# EAGLE design H2OhNo-v10 (EAGLE 6.3)
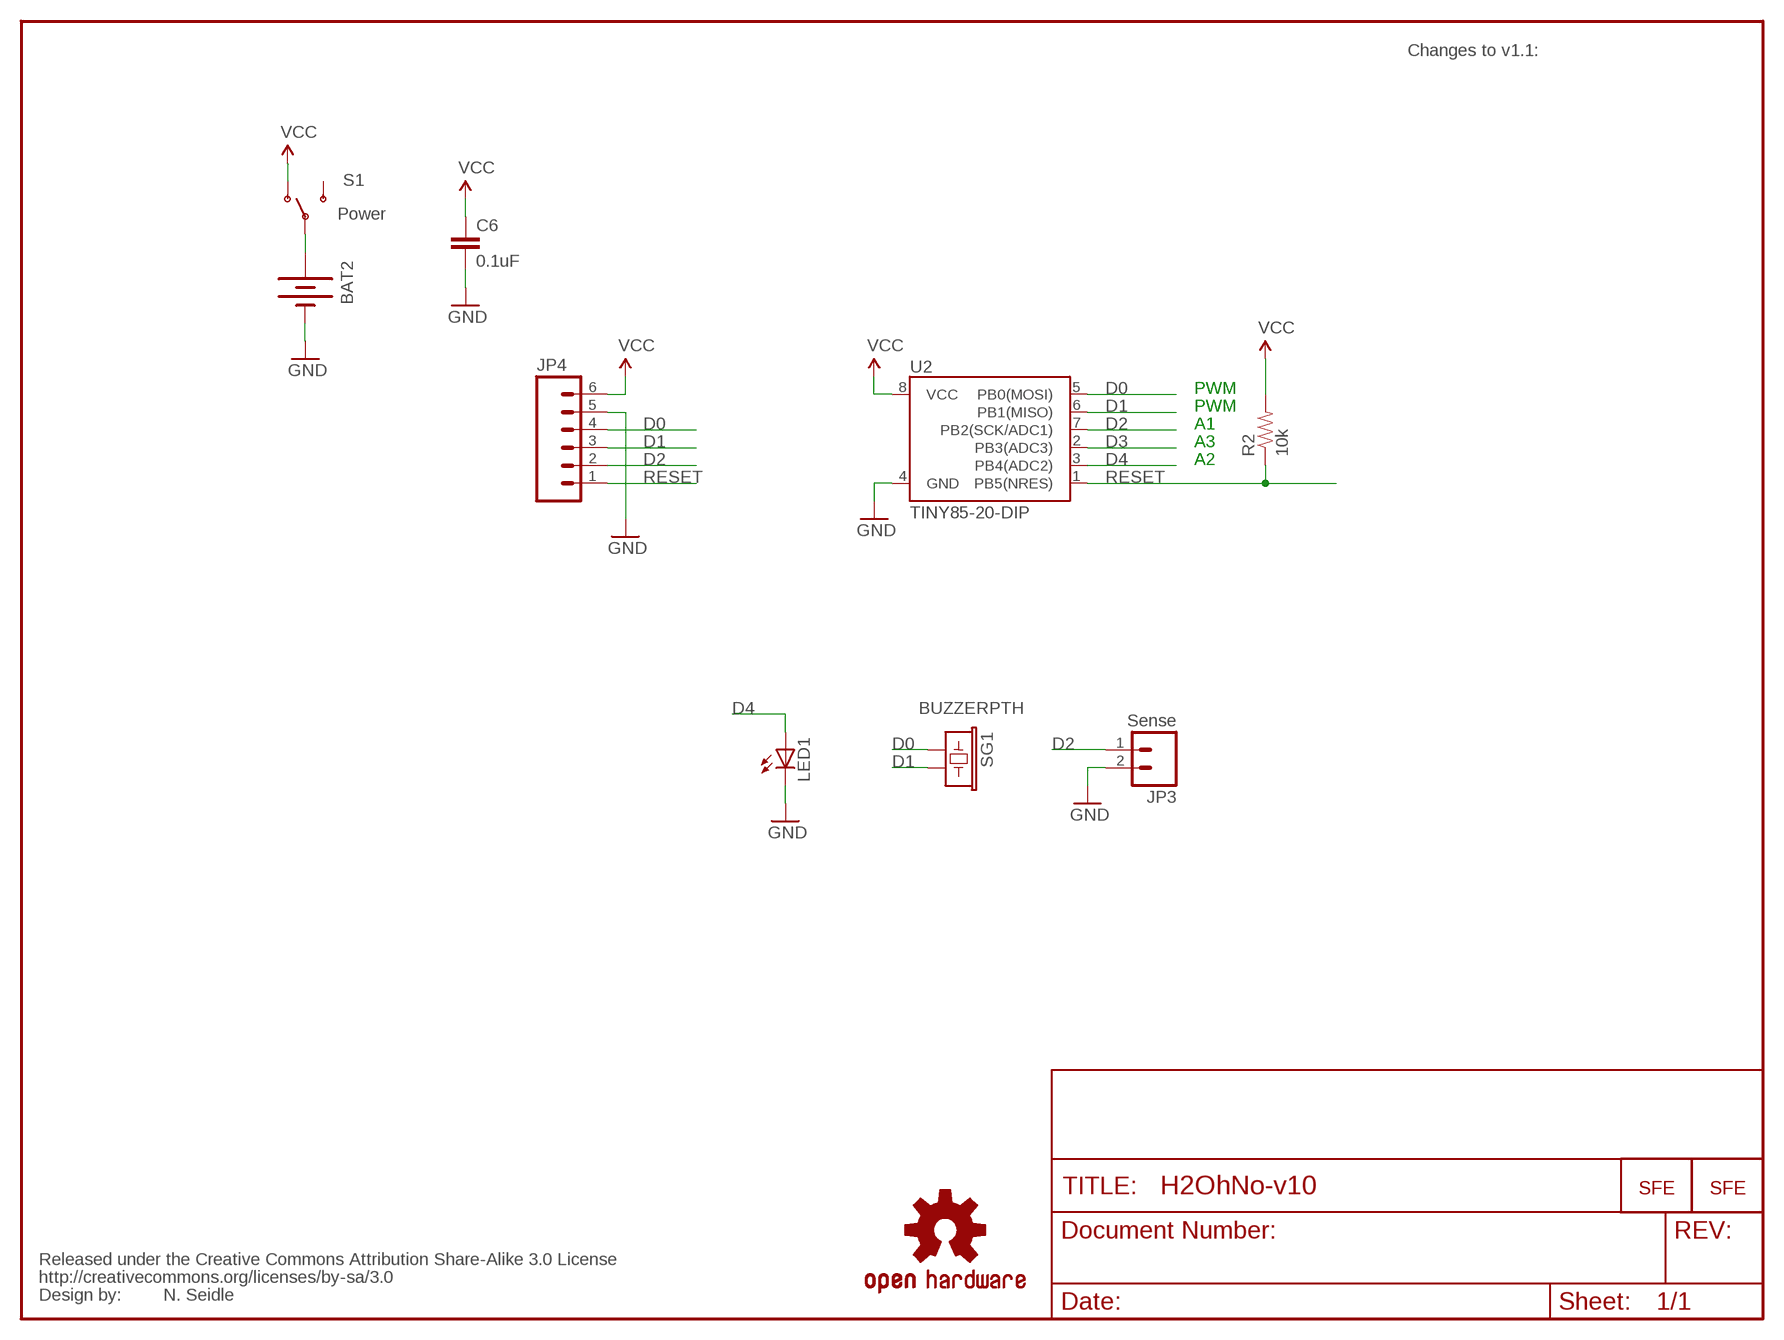
[diagram p0: schematic, sheet 1]

## Parts
BAT2  BATTERY20PTH  [BATTCOM_20MM_PTH]
C6  0.1uF  CAPPTH2  [CAP-PTH-SMALL2]
JP3  Sense  M02PTH  [1X02]
JP4  M06SIP  [1X06]
LED1  LED5MM  [LED5MM]
R2  10k  RESISTORAXIAL-0.3  [AXIAL-0.3]
S1  Power  SWITCH-SPDTPTH  [SWITCH-SPDT]
SG1  BUZZERPTH  [BUZZER-12MM]
U2  TINY85-20-DIP  ATTINY45TINY85-20-DIP  [DIP08]
U$1  LOGO-SFESK  [SFE-LOGO-FLAME]
U$2  CREATIVE_COMMONS  [CREATIVE_COMMONS]
U$4  OSHW-LOGOS  [OSHW-LOGO-S]
U$5  LOGO-SFENW2  [SFE-NEW-WEB]

## Nets
D0: JP4.4 SG1.+ U2.5(PB0(MOSI))
D1: JP4.3 SG1.- U2.6(PB1(MISO))
D2: JP3.1 JP4.2 U2.7(PB2(SCK/ADC1))
D3: U2.2(PB3(ADC3))
D4: LED1.A U2.3(PB4(ADC2))
GND: BAT2.2(-) C6.2 JP3.2 JP4.5 LED1.K(C) U2.4(GND)
N$1: BAT2.1(+) S1.2(P)
RESET: JP4.1 R2.P$1 U2.1(PB5(NRES))
VCC: C6.1 JP4.6 R2.P$2 S1.1(O) U2.8(VCC)
Unconnected: S1.3(S)

## Notes on the sheet
- Changes to v1.1:
- PWM
- PWM
- A1
- A3
- A2
- N. Seidle

## Library data of the parts
BAT2 = Testing:BATTERY: Battery Holders Various common sizes : AA, AAA, 20mm coin cell and 12mm coin cell.
C6 = SparkFun:CAP: Capacitor Standard 0603 ceramic capacitor, and 0.1" leaded capacitor.
JP3 = SparkFun-Connectors:M02: Header 2 Standard 2-pin 0.1" header. Use with straight break away headers (SKU : PRT-00116), right angle break away headers (PRT-00553), swiss pins (PRT-00743), machine pins (PRT-00117), and female headers (PRT-00115). Molex polarized connector foot print use with SKU : PRT-08233 with associated crimp pins and housings.
JP4 = SparkFun-Connectors:M06: Header 6 Standard 6-pin 0.1" header. Use with straight break away headers (SKU : PRT-00116), right angle break away headers (PRT-00553), swiss pins (PRT-00743), machine pins (PRT-00117), and female headers (PRT-00115). Molex polarized connector foot print use with SKU : PRT-08094 with associated crimp pins and housings. NOTES ON THE VARIANTS LOCK and LOCK_LONGPADS... This footprint was designed to help hold the alignment of a through-hole component (i.e. 6-pin header) while soldering it into place. You may notice that each hole has been shifted either up or down by 0.005 of an inch from it's more standard position (which is a perfectly straight line). This slight alteration caused the pins (the squares in the middle) to touch the edges of the holes. Because they are alternating, it causes a "brace" to hold the component in place. 0.005 has proven to be the perfect amount of "off-center" position when using our standard breakaway headers. Although looks a little odd when you look at the bare footprint, once you have a header in there, the alteration is very hard to notice. Also, if you push a header all the way into place, it is covered up entirely on the bottom side. This idea of altering the position of holes to aid alignment will be further integrated into the Sparkfun Library for other footprints. It can help hold any component with 3 or more connection pins.
LED1 = SparkFun-LED:LED: LEDs Standard schematic elements and footprints for 5mm, 3mm, 1206, and 0603 sized LEDs. 5mm - Spark Fun Electronics SKU : COM-00529 (and others)
R2 = SparkFun:RESISTOR: Resistor Basic schematic elements and footprints for 0603, 1206, and PTH resistors.
S1 = SparkFun-Electromechanical:SWITCH-SPDT: SPDT Switch Simple slide switch, Spark Fun Electronics SKU : COM-00102 DPDT SMT slide switch, AYZ0202, SWCH-08179
SG1 = SparkFun-Electromechanical:BUZZER: Buzzer 12mm Spark Fun Electronics SKU : Comp-Buzzer
U2 = SparkFun-DigitalIC:ATTINY45: Atmel 8-pin 2/4/8kB flash uC; PROD_ID: IC-09445
U$1 U$5 = SparkFun:LOGO-SFE: Spark Fun Electronics PCB Logo This is the standard Spark Fun Electronics PCB logo.
U$2 = SparkFun:CREATIVE_COMMONS
U$4 = SparkFun:OSHW-LOGO: Open Source Hardware Logo This logo indicates the piece of hardware it is found on incorporates a OSHW license and/or adheres to the definition of open source hardware found here: http://freedomdefined.org/OSHW

## Board
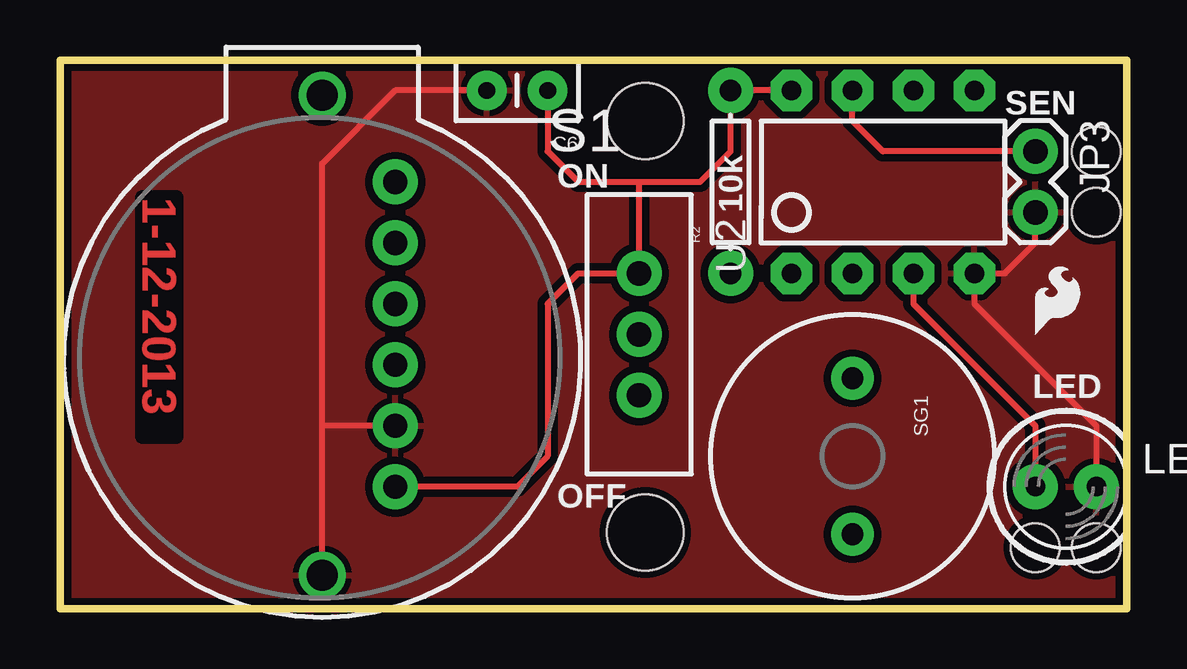
[diagram p1: board, top side]
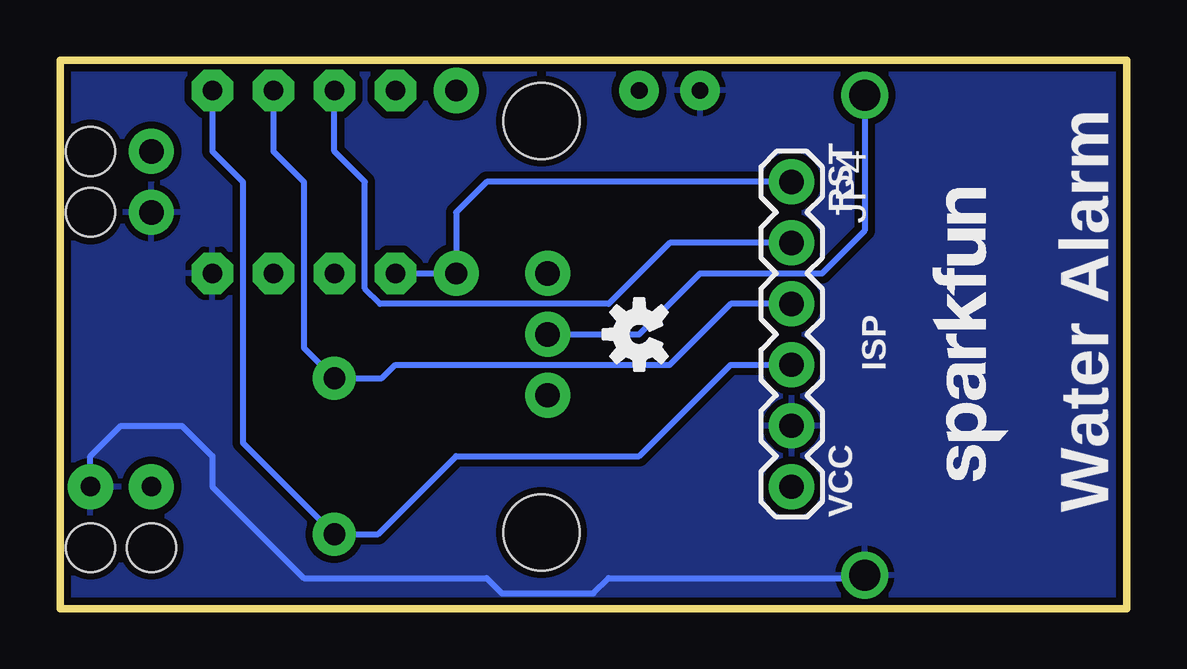
[diagram p2: board, bottom side, seen from below]

Size 44.45 x 22.86 mm. Coordinates in mm from the lower left corner, seen from the top.
Outline: 0,22.86 0,0 44.45,0 44.45,22.86 0,22.86
Copper layers (1*16): Top 0.035mm / dielectric 1.5mm / Bottom 0.035mm
Design rules "SparkFun": minimum track width 8mil, minimum drill 20mil, track to track 8mil, track to pad 8mil, pad to pad 8mil, via to via 8mil, smd to smd 8mil, copper to edge 10mil, drill to drill 8mil, minimum pad ring 12mil, minimum via ring 10mil, stop-mask expansion 4mil, vias tented up to drill 25mil, thermal gap 10mil
Holes 3.17 mm at 24.38,20.32 24.38,3.17
Holes 2.03 mm at 43.18,19.05 43.18,16.51 40.64,2.54 43.18,2.54

### Footprints (pad centres in the part's own frame; a part is rotated, then mirrored left to right if it is on the bottom)
BATTCOM_20MM_PTH = drill 1.3: 1 20,0; 2 0,0
CAP-PTH-SMALL2 = drill 0.7 pad 1.651: 1 0,0; 2 2.54,0
1X02 = drill 1.016 pad 1.88: 1 0,0; 2 2.54,0
1X06 = drill 1.016 pad 1.88: 1 0,0; 2 2.54,0; 3 5.08,0; 4 7.62,0; 5 10.16,0; 6 12.7,0
LED5MM = drill 0.813 pad 1.88: A -1.27,0; K 1.27,0
AXIAL-0.3 = drill 0.9 pad 1.88: P$1 -3.81,0; P$2 3.81,0
SWITCH-SPDT = drill 1.016 pad 1.88: 1 0,2.54; 2 0,0; 3 0,-2.54
BUZZER-12MM = drill 0.9 pad 1.778: + 3.25,0; - -3.25,0
DIP08 = drill 0.813 pad 1.727 octagon: 1 -3.81,-3.81; 2 -1.27,-3.81; 3 1.27,-3.81; 4 3.81,-3.81; 5 3.81,3.81; 6 1.27,3.81; 7 -1.27,3.81; 8 -3.81,3.81

### Placement (x,y rotation side)
BAT2  10.92,1.4 90 top
C6  20.32,21.59 180 top
JP3  40.64,19.05 270 top
JP4  13.97,17.78 270 bottom
LED1  41.91,5.08 0 top
R2  27.94,17.78 90 top
S1  24.13,11.43 0 top
SG1  33.02,6.35 270 top
U2  34.29,17.78 0 top
U$1  40.64,11.43 0 top
U$2  -6.35,-10.16 0 top  (outside the outline)
U$4  20.32,11.43 90 bottom
U$5  4.95,5.33 90 bottom

### Tracks (layer width: path | path; a pad name or v marks a point on that pad's centre or on a via)
D0
  Bottom 0.254: U2.5 38.1,19.05 36.83,17.78 36.83,6.91 SG1.+ 31.19,3.1 27.94,6.35 20.32,6.35 16.51,10.16 JP4.4
D1
  Bottom 0.254: JP4.3 16.51,12.7 19.05,10.16 30.48,10.16 31.04,9.6 SG1.- 34.29,10.87 34.29,17.78 35.56,19.05 U2.6
D2
  Top 0.254: JP3.1 34.29,19.05 33.02,20.32 U2.7
  Bottom 0.254: JP4.2 19.05,15.24 21.59,12.7 31.11,12.7 31.75,13.34 31.75,17.78 33.02,19.05 U2.7
D4
  Top 0.254: U2.3 35.56,12.7 40.64,7.62 LED1.A
GND
  Top 0.254: JP3.2 40.64,15.24 39.37,13.97 U2.4 38.1,12.7 43.18,7.62 LED1.K | C6.2 13.97,21.59 10.92,18.54 10.92,7.62 | BAT2.2 10.92,7.62 | JP4.5 10.92,7.62
  Bottom 0.254: LED1.K 43.18,6.35 41.91,7.62 39.37,7.62 38.1,6.35 38.1,5.08 34.29,1.27 26.67,1.27 26.04,0.64 22.23,0.64 21.59,1.27 11.05,1.27 BAT2.2
  pour Bottom (isolate 0.305): 0,22.86 44.45,22.86 44.45,0 0,0
  pour Top (isolate 0.305): 0,22.86 44.45,22.86 44.45,0 0,0
N$1
  Bottom 0.254: S1.2 20.32,11.43 17.78,13.97 12.7,13.97 10.92,15.75 BAT2.1
RESET
  Bottom 0.254: JP4.1 26.67,17.78 27.94,16.51 R2.P$1 U2.1
VCC
  Top 0.254: U2.8 R2.P$2 27.94,19.05 26.67,17.78 24.13,17.78 | JP4.6 19.05,5.08 20.32,6.35 20.32,12.7 21.59,13.97 S1.1 24.13,17.78 | C6.1 20.32,19.05 21.59,17.78 24.13,17.78

### Text on the board
Top: 1-12-2013
tPlace: SEN | ON | LED | OFF
bPlace: Water Alarm | RST | ISP | VCC
tDocu: N. Seidle